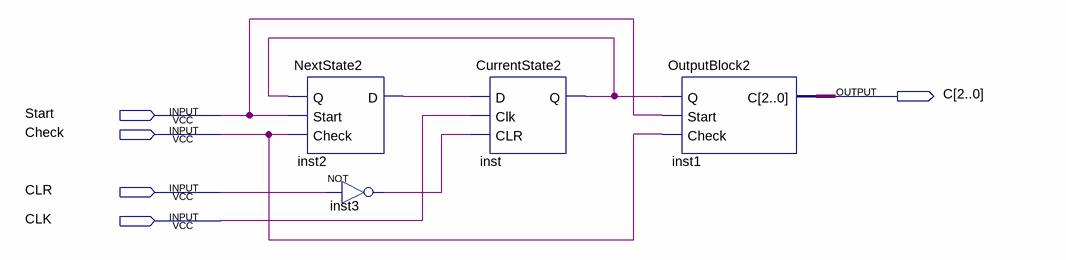
[diagram p0: schematic sheet]
// Quartus schematic Control2.bdf as structural Verilog: 4 symbols, 5 pins
module Control2 (
  input  Start,
  input  Check,
  input  CLR,
  input  CLK,
  output [2:0] C
);

  wire inst2_d, inst3_out, inst_q;

  NextState2 inst2 (.Q(inst_q), .Start(Start), .Check(Check), .D(inst2_d));
  not inst3 (inst3_out, CLR);
  CurrentState2 inst (.D(inst2_d), .Clk(CLK), .CLR(inst3_out), .Q(inst_q));
  OutputBlock2 inst1 (.Q(inst_q), .Start(Start), .Check(Check), .C(C));
endmodule
